# EAGLE design Apex_CV_Expander_3U_UI_v1.0 (EAGLE 9.6.0)
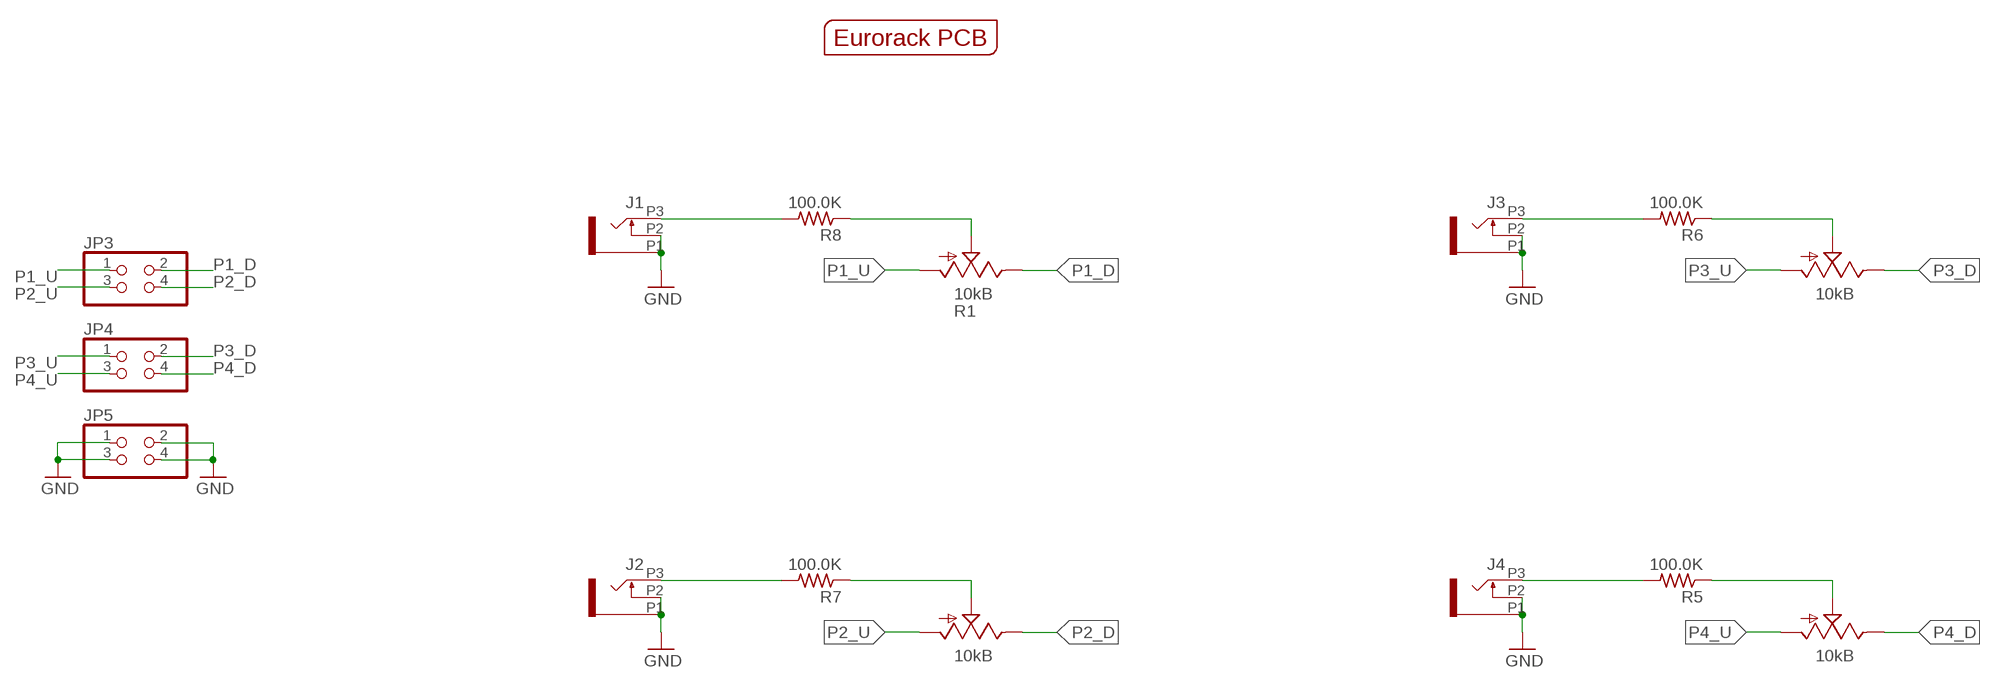
[diagram p0: schematic, sheet 1]

## Parts
J1  OG-PJ301_PJ301_THONKICONN7  [OG-PJ301_WQP_PJ_301M7]
J2  OG-PJ301_PJ301_THONKICONN7  [OG-PJ301_WQP_PJ_301M7]
J3  OG-PJ301_PJ301_THONKICONN7  [OG-PJ301_WQP_PJ_301M7]
J4  OG-PJ301_PJ301_THONKICONN7  [OG-PJ301_WQP_PJ_301M7]
JP3  PINHD-2X2  [2X02]
JP4  PINHD-2X2  [2X02]
JP5  PINHD-2X2  [2X02]
PCB1  EURORACK_PCB2HP  [EURORACK2HPPCB]
R1  10kB  POTS_POT_USSLOTED_TALL_TRIMMER  [POTS_TALL_TRIMMER_POT_VERTICAL_SLOTED]
R2  10kB  POTS_POT_USSLOTED_TALL_TRIMMER  [POTS_TALL_TRIMMER_POT_VERTICAL_SLOTED]
R3  10kB  POTS_POT_USSLOTED_TALL_TRIMMER  [POTS_TALL_TRIMMER_POT_VERTICAL_SLOTED]
R4  10kB  POTS_POT_USSLOTED_TALL_TRIMMER  [POTS_TALL_TRIMMER_POT_VERTICAL_SLOTED]
R5  100.0K  R-US_R0603  [R0603]
R6  100.0K  R-US_R0603  [R0603]
R7  100.0K  R-US_R0603  [R0603]
R8  100.0K  R-US_R0603  [R0603]

## Nets
GND: J1.P1 J1.P2 J2.P1 J2.P2 J3.P1 J3.P2 J4.P1 J4.P2 JP5.1 JP5.2 JP5.3 JP5.4
N$1: J1.P3 R8.2
N$2: R1.P$2(S) R8.1
N$7: J2.P3 R7.2
N$8: R2.P$2(S) R7.1
N$13: J3.P3 R6.2
N$14: R3.P$2(S) R6.1
N$19: J4.P3 R5.2
N$20: R4.P$2(S) R5.1
P1_D: JP3.2 R1.P$1(E)
P1_U: JP3.1 R1.P$3(A)
P2_D: JP3.4 R2.P$1(E)
P2_U: JP3.3 R2.P$3(A)
P3_D: JP4.2 R3.P$1(E)
P3_U: JP4.1 R3.P$3(A)
P4_D: JP4.4 R4.P$1(E)
P4_U: JP4.3 R4.P$3(A)

## Library data of the parts
J1-J4 = SHAY_THONKICONNS:OG-PJ301_PJ301_THONKICONN
JP3-JP5 = pinhead:PINHD-2X2: PIN HEADER
PCB1 = EurorackModularParts:EURORACK_PCB
R1-R4 = POTS:POTS_POT_US
R5-R8 = rcl:R-US_: RESISTOR, American symbol

## Board
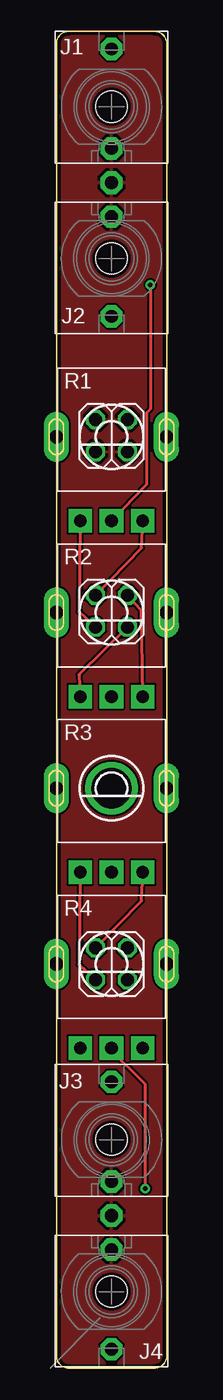
[diagram p1: board, top side]
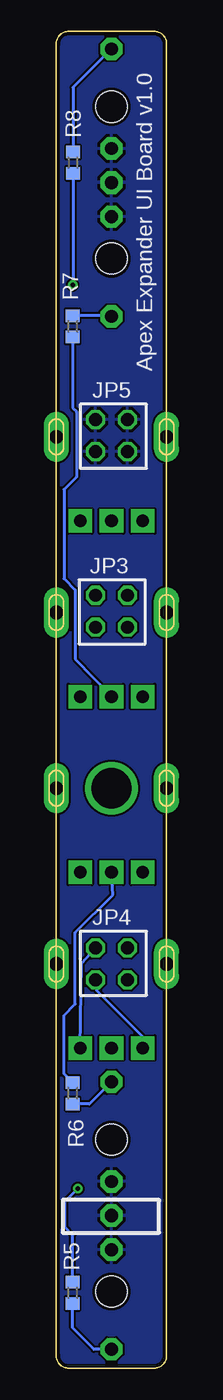
[diagram p2: board, bottom side, seen from below]

Size 8.82 x 106.5 mm. Coordinates in mm from the lower left corner, seen from the top.
Copper layers (1*16): Top 0.035mm / dielectric 1.5mm / Bottom 0.035mm
Design rules "default *": minimum track width 6mil, minimum drill 0.35mm, track to track 6mil, track to pad 6mil, pad to pad 6mil, via to via 6mil, smd to smd 6mil, copper to edge 10mil, drill to drill 6mil, minimum pad ring 10mil, minimum via ring 8mil, stop-mask expansion 4mil, vias tented up to drill 25mil, thermal gap 10mil

### Footprints (pad centres in the part's own frame; a part is rotated, then mirrored left to right if it is on the bottom)
OG-PJ301_WQP_PJ_301M7 = drill 1.016 pad 1.778 octagon: P1 0,-6.032; P2 0,-3.334; P3 0,4.604 | hole 2.5: 0,0
2X02 = drill 1.016 octagon: 1 -1.27,-1.27; 2 -1.27,1.27; 3 1.27,-1.27; 4 1.27,1.27
POTS_TALL_TRIMMER_POT_VERTICAL_SLOTED = drill 1 pad 1.88 square: P$1 -2.5,6.7; P$2 0,6.7; P$3 2.5,6.7 | drill 1.1 pad 2 long: P$4 -4.4,0; P$5 4.4,0
R0603 = smd 1 x 1.1: 1 -0.85,0; 2 0.85,0

### Placement (x,y rotation side)
J1  4.4,100.5 0 top
J2  4.4,88.4 180 top
J3  4.4,18.2 0 top
J4  4.4,6.1 180 top
JP3  4.4,60.3 0 top
JP4  4.4,32.2 0 top
JP5  4.4,74.3 0 top
PCB1  -0.5,0 0 top
R1  4.4,74.2 180 top
R2  4.4,60.2 180 top
R3  4.4,46.2 180 top
R4  4.4,32.2 180 top
R5  7.5,6 270 bottom
R6  7.5,21.9 270 bottom
R7  7.5,83 90 bottom
R8  7.47,96.04 90 bottom

### Tracks (layer width: path | path; a pad name or v marks a point on that pad's centre or on a via)
GND
  pour Top: -0.1,0.1 -0.1,106.5 8.7,106.5 8.8,106.5 8.8,0.1
  pour Bottom: -0.1,0.1 -0.1,106.5 8.7,106.5 8.8,106.5 8.8,0.1
N$1
  Bottom 0.254: J1.P3 7.47,102.03 R8.2
N$2  (via drill 0.35)
  Top 0.254: v7.5,86.3 7.5,76.4 7.2,76.1 7.2,70.4 R1.P$2
  Bottom 0.254: R8.1 7.47,86.33 v7.5,86.3
N$3  (via drill 3.2)
  other vias: 4.4,46.2
N$7
  Bottom 0.254: J2.P3 4.45,83.85 R7.2
N$8
  Bottom 0.254: R7.1 7.5,76.5 7.2,76.2 7.2,71 8.2,70 8.2,62.9 7.3,62 7.3,56.5 R2.P$2
N$13
  Bottom 0.254: J3.P3 6.15,21.05 R6.2
N$14
  Bottom 0.254: R6.1 8.2,23.45 8.2,28.1 7.3,29 7.3,34.7 4.3,37.7 R3.P$2
N$19
  Bottom 0.254: J4.P3 5.8,1.5 7.5,3.2 R5.2
N$20  (via drill 0.35)
  Top 0.254: v7.1,14.3 7.1,22.6 4.3,25.4 R4.P$2
  Bottom 0.254: R5.1 7.5,10.6 8.1,11.2 8.1,13.3 v7.1,14.3
P1_D
  Top 0.254: JP3.2 6.8,65.34 R1.P$1
P1_U
  Top 0.254: JP3.1 1.8,60.26 R1.P$3
P2_D
  Top 0.254: R2.P$1 6.8,60.34 JP3.4
P2_U
  Top 0.254: JP3.3 1.8,55.26 R2.P$3
P3_D
  Top 0.254: JP4.2 6.8,37.24 R3.P$1
P3_U
  Top 0.254: JP4.1 1.8,32.16 R3.P$3
P4_D
  Bottom 0.254: JP4.4 6.8,32.24 R4.P$1
P4_U
  Bottom 0.254: R4.P$3 1.8,26.3 5.57,30.07 JP4.3

### Text on the board
bPlace: Apex Expander UI Board v1.0